# EAGLE design PSU v1.0 (EAGLE 9.1.3)
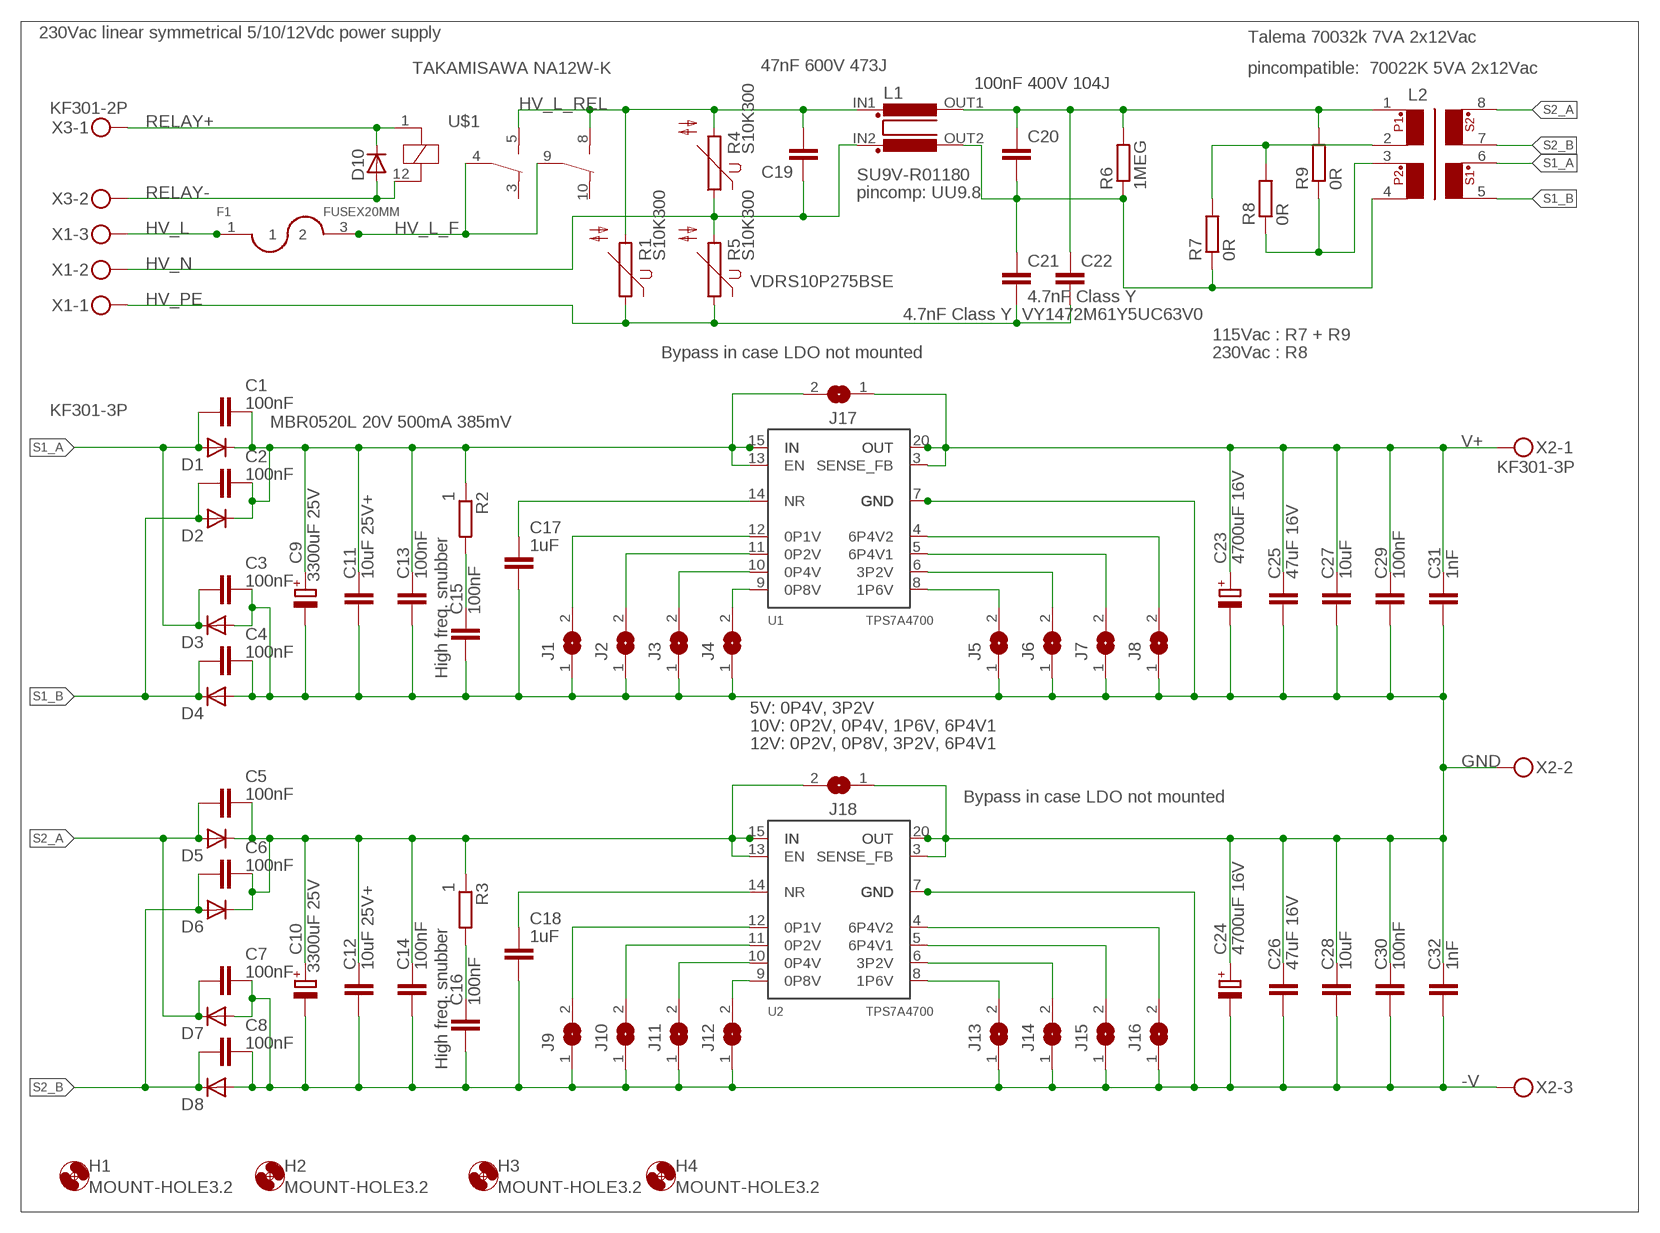
[diagram p0: schematic, sheet 1]

## Parts
C1  100nF  C-EUC0603  [C0603]
C2  100nF  C-EUC0603  [C0603]
C3  100nF  C-EUC0603  [C0603]
C4  100nF  C-EUC0603  [C0603]
C5  100nF  C-EUC0603  [C0603]
C6  100nF  C-EUC0603  [C0603]
C7  100nF  C-EUC0603  [C0603]
C8  100nF  C-EUC0603  [C0603]
C9  3300uF 25V  CPOL-EUE7.5-16  [E7,5-16]
C10  3300uF 25V  CPOL-EUE7.5-16  [E7,5-16]
C11  10uF 25V+  C-EUC1206  [C1206]
C12  10uF 25V+  C-EUC1206  [C1206]
C13  100nF  C-EUC0603  [C0603]
C14  100nF  C-EUC0603  [C0603]
C15  100nF  C-EUC0603  [C0603]
C16  100nF  C-EUC0603  [C0603]
C17  1uF  C-EUC0603  [C0603]
C18  1uF  C-EUC0603  [C0603]
C19  47nF 600V 473J  C-EU102-054X133  [C102-054X133]
C20  100nF 400V 104J  C-EU102-064X133  [C102-064X133]
C21  4.7nF Class Y VY1472M61Y5UC63V0  C-EU102-043X133  [C102-043X133]
C22  4.7nF Class Y  C-EU102-043X133  [C102-043X133]
C23  4700uF 16V  CPOL-EUE7.5-16  [E7,5-16]
C24  4700uF 16V  CPOL-EUE7.5-16  [E7,5-16]
C25  47uF 16V  C-EUC1210  [C1210]
C26  47uF 16V  C-EUC1210  [C1210]
C27  10uF  C-EUC1206  [C1206]
C28  10uF  C-EUC1206  [C1206]
C29  100nF  C-EUC0603  [C0603]
C30  100nF  C-EUC0603  [C0603]
C31  1nF  C-EUC0603  [C0603]
C32  1nF  C-EUC0603  [C0603]
D1  MBR0520L 20V 500mA 385mV  D-SOD123  [SOD123]
D2  D-SOD123  [SOD123]
D3  D-SOD123  [SOD123]
D4  D-SOD123  [SOD123]
D5  D-SOD123  [SOD123]
D6  D-SOD123  [SOD123]
D7  D-SOD123  [SOD123]
D8  D-SOD123  [SOD123]
D10  ES1A 50V 1A 25ns  D-SOD123  [SOD123]
F1  FUSEX20MM  [FUSE_5MM]
H1  MOUNT-HOLE3.2  [3,2]
H2  MOUNT-HOLE3.2  [3,2]
H3  MOUNT-HOLE3.2  [3,2]
H4  MOUNT-HOLE3.2  [3,2]
J1  SJ  [SJ]
J2  SJ  [SJ]
J3  SJ  [SJ]
J4  SJ  [SJ]
J5  SJ  [SJ]
J6  SJ  [SJ]
J7  SJ  [SJ]
J8  SJ  [SJ]
J9  SJ  [SJ]
J10  SJ  [SJ]
J11  SJ  [SJ]
J12  SJ  [SJ]
J13  SJ  [SJ]
J14  SJ  [SJ]
J15  SJ  [SJ]
J16  SJ  [SJ]
J17  SJ  [SJ]
J18  SJ  [SJ]
L1  SU9V-R01180  [SU9V-R01180]
L2  Talema 70032k 7VA 2x12Vac  TALEMA_70000  [TALEMA_70000]
R1  S10K300  [S10K300]
R2  1  R-EU_R0603  [R0603]
R3  1  R-EU_R0603  [R0603]
R4  S10K300  [S10K300]
R5  S10K300  [S10K300]
R6  1MEG  R-EU_0309/12  [0309/12]
R7  0R  R-EU_0204/7  [0204/7]
R8  0R  R-EU_0204/7  [0204/7]
R9  0R  R-EU_0204/7  [0204/7]
U1  TPS7A4700  [VQFN20]
U2  TPS7A4700  [VQFN20]
U$1  TAKAMISAWA NA12W-K  NA_RELAY  [NA_RELAY]
X1  KF301-3P  [KF301-3P]
X2  KF301-3P  [KF301-3P]
X3  KF301-2P  [KF301-2P]

## Nets
-V: C7.2 C8.2 C10.- C12.1 C14.1 C16.1 C18.1 C24.- C26.2 C28.1 C30.1 C32.1 D7.2(A) D8.2(A) J9.1 J10.1 J11.1 J12.1 J13.1 J14.1 J15.1 J16.1 U2.7(GND) U2.17(GND) U2.18(GND) U2.19(GND) U2.21(GND) X2.3
GND: C3.2 C4.2 C9.- C11.1 C13.1 C15.1 C17.1 C23.- C24.+ C25.2 C26.1 C27.1 C28.2 C29.1 C30.2 C31.1 C32.2 D3.2(A) D4.2(A) J1.1 J2.1 J3.1 J4.1 J5.1 J6.1 J7.1 J8.1 J18.1 U1.7(GND) U1.17(GND) U1.18(GND) U1.19(GND) U1.21(GND) U2.1(OUT) U2.3(SENSE_FB) U2.20(OUT) X2.2
HV_L: F1.1 F1.2 X1.3
HV_L_F: F1.3 F1.4 U$1.4(A) U$1.9(B)
HV_L_REL: C19.1 L1.IN1 R1.2 R4.2 U$1.5(A_NO) U$1.8(B_NO)
HV_N: C19.2 L1.IN2 R4.1 R5.2 X1.2
HV_PE: C21.2 C22.2 R1.1 R5.1 X1.1
N$1: C5.2 C6.2 C10.+ C12.2 C14.2 D5.1(C) D6.1(C) J18.2 R3.1 U2.13(EN) U2.15(IN) U2.16(IN)
N$2: C16.2 R3.2
N$3: C20.1 C22.1 L1.OUT1 L2.1 R6.2 R9.2
N$4: C20.2 C21.1 L1.OUT2 L2.4 R6.1 R7.1
N$5: C15.2 R2.2
N$6: C18.2 U2.14(NR)
N$7: L2.2 R7.2 R8.2
N$8: L2.3 R8.1 R9.1
N$9: C1.2 C2.2 C9.+ C11.2 C13.2 D1.1(C) D2.1(C) J17.2 R2.1 U1.13(EN) U1.15(IN) U1.16(IN)
N$11: J13.2 U2.8(1P6V)
N$13: J14.2 U2.6(3P2V)
N$15: C17.2 U1.14(NR)
N$18: J15.2 U2.5(6P4V1)
N$19: J5.2 U1.8(1P6V)
N$20: J6.2 U1.6(3P2V)
N$21: J7.2 U1.5(6P4V1)
N$22: J8.2 U1.4(6P4V2)
N$23: J16.2 U2.4(6P4V2)
N$24: J1.2 U1.12(0P1V)
N$25: J2.2 U1.11(0P2V)
N$26: J3.2 U1.10(0P4V)
N$27: J4.2 U1.9(0P8V)
N$28: J9.2 U2.12(0P1V)
N$29: J10.2 U2.11(0P2V)
N$30: J11.2 U2.10(0P4V)
N$31: J12.2 U2.9(0P8V)
RELAY+: D10.1(C) U$1.1(C+) X3.2
RELAY-: D10.2(A) U$1.12(C-) X3.3
S1_A: C1.1 C3.1 D1.2(A) D3.1(C) L2.6
S1_B: C2.1 C4.1 D2.2(A) D4.1(C) L2.5
S2_A: C5.1 C7.1 D5.2(A) D7.1(C) L2.8
S2_B: C6.1 C8.1 D6.2(A) D8.1(C) L2.7
V+: C23.+ C25.1 C27.2 C29.2 C31.2 J17.1 U1.1(OUT) U1.3(SENSE_FB) U1.20(OUT) X2.1
Unconnected: U$1.3(A_NC) U$1.10(B_NC)

## Notes on the sheet
- 230Vac linear symmetrical 5/10/12Vdc power supply
- pincompatible:  70022K 5VA 2x12Vac
- pincomp: UU9.8
- VDRS10P275BSE
- 115Vac : R7 + R9
- Bypass in case LDO not mounted | 230Vac : R8
- High freq. snubber
- 5V: 0P4V, 3P2V
- 10V: 0P2V, 0P4V, 1P6V, 6P4V1
- 12V: 0P2V, 0P8V, 3P2V, 6P4V1
- Bypass in case LDO not mounted
- High freq. snubber

## Library data of the parts
C1-C8 C11-C22 C25-C32 = rcl:C-EU: CAPACITOR, European symbol
C9 C10 C23 C24 = rcl:CPOL-EU: POLARIZED CAPACITOR, European symbol
D1-D8 D10 = semicon-smd-ipc:D-: DIODE unfilled
F1 = SparkFun:FUSE
H1-H4 = holes:MOUNT-HOLE: MOUNTING HOLE with drill center marker
J1-J18 = jumper:SJ: SMD solder JUMPER
L1 = trafo_JBK:SU9V-R01180
L2 = trafo_JBK:TALEMA_70000: TRANSFORMER 2 primary winding, 2 secondary windings, mounting holes Talema 70032K
R1 R4 R5 = varistor:S10K300: VARISTOR
R2 R3 R6-R9 = rcl:R-EU_: RESISTOR, European symbol
U1 U2 = trafo_JBK:TPS7A4700: The TPS7A47 is a family of positive voltage (+36 V), ultralow-noise (4 µVRMS) low-dropout linear regulators (LDO) capable of sourcing a 1-A load. The TPS7A4700 output voltages are user-programmable (up to 20.5 V) using a printed circuit board (PCB) layout without the need of external resistors or feed-forward capacitors, thus reducing overall component count. The TPS7A4701 output voltage can be configured with a user-programmable PCB layout (up to 20.5 V), or adjustable (up to 34 V) with external feedback resistors. The TPS7A47 is designed with bipolar technology primarily for high-accuracy, high-precision instrumentation applications where clean voltage rails are critical to maximize system performance. This feature makes the device ideal for powering operational amplifiers, analog-to-digital converters (ADCs), digital-to-analog converters (DACs), and other high-performance analog circuitry in critical applications such as medical, radio frequency (RF), and test-and-measurement. In addition, the TPS7A47 is ideal for post dc-dc converter regulation. By filtering out the output voltage ripple inherent to dc-dc switching conversions, maximum system performance is ensured in sensitive instrumentation, test-and-measurement, audio, and RF applications. For applications where positive and negative low-noise rails are required, consider TI’s TPS7A33 family of negative high-voltage, ultralow-noise linear regulators.
U$1 = JBK:NA_RELAY: Fujitsu NA series Slim type relay for high density mounting
X1 X2 = JBK:KF301-3P: KF301-3P connector Ebay KF301-3P Screw Terminal Block Connector 5.08mm Pitch 300V/16A (14-22AWG)
X3 = JBK:KF301-2P: KF301-2P connector Ebay KF301-2P Screw Terminal Block Connector 5.08mm Pitch 300V/16A (14-22AWG)

## Board
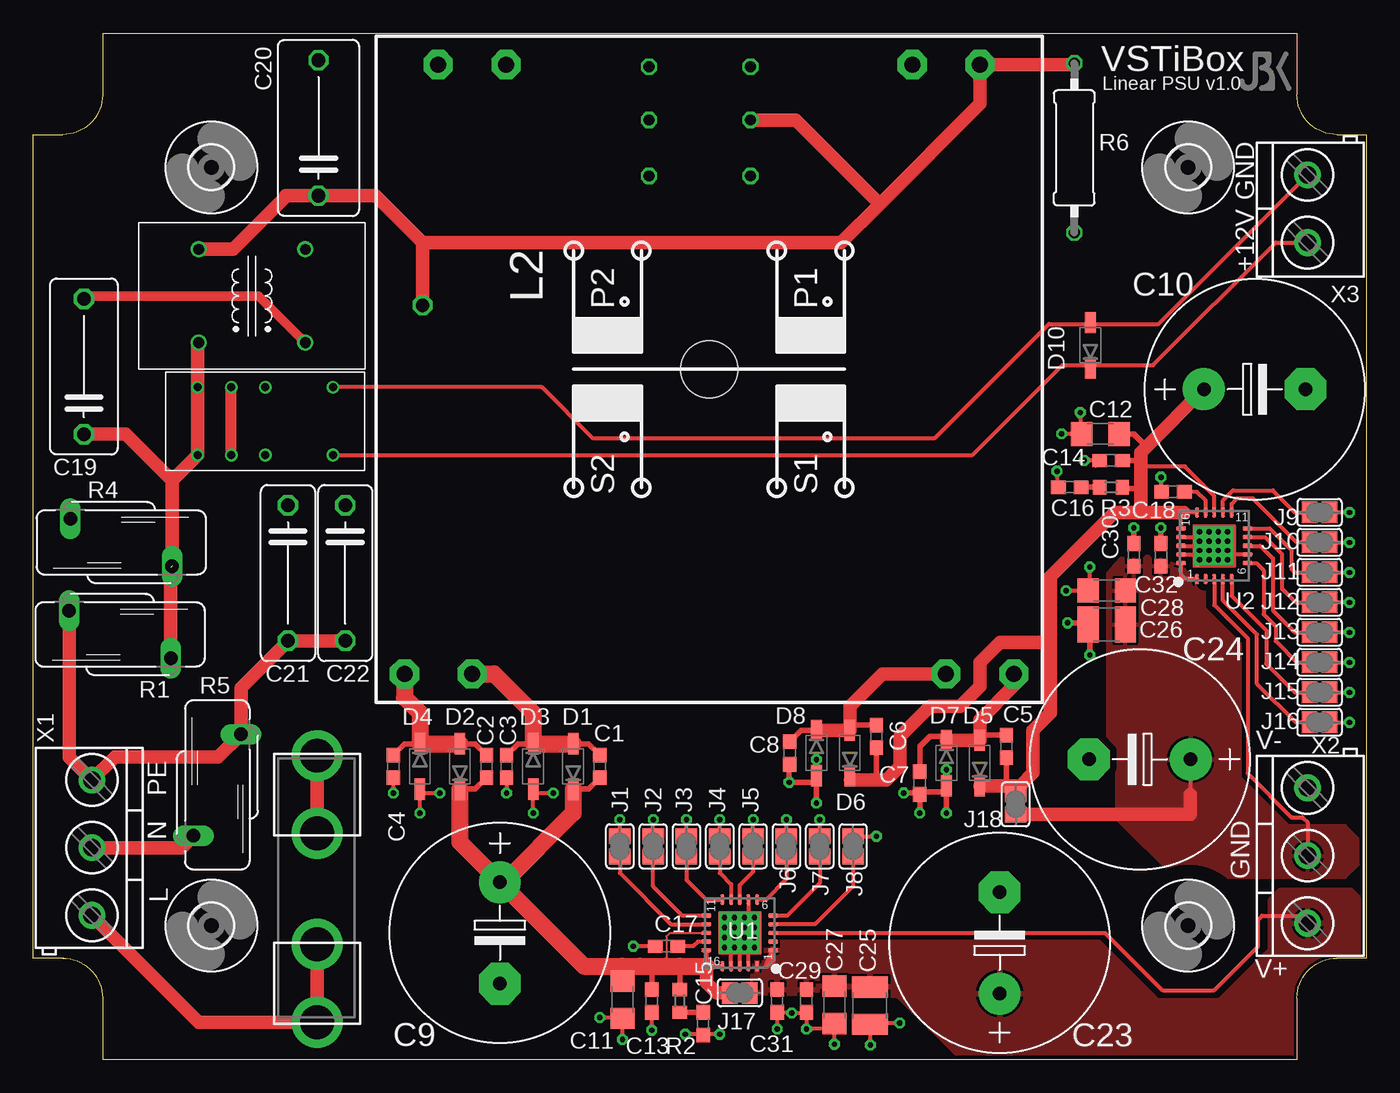
[diagram p1: board, top side]
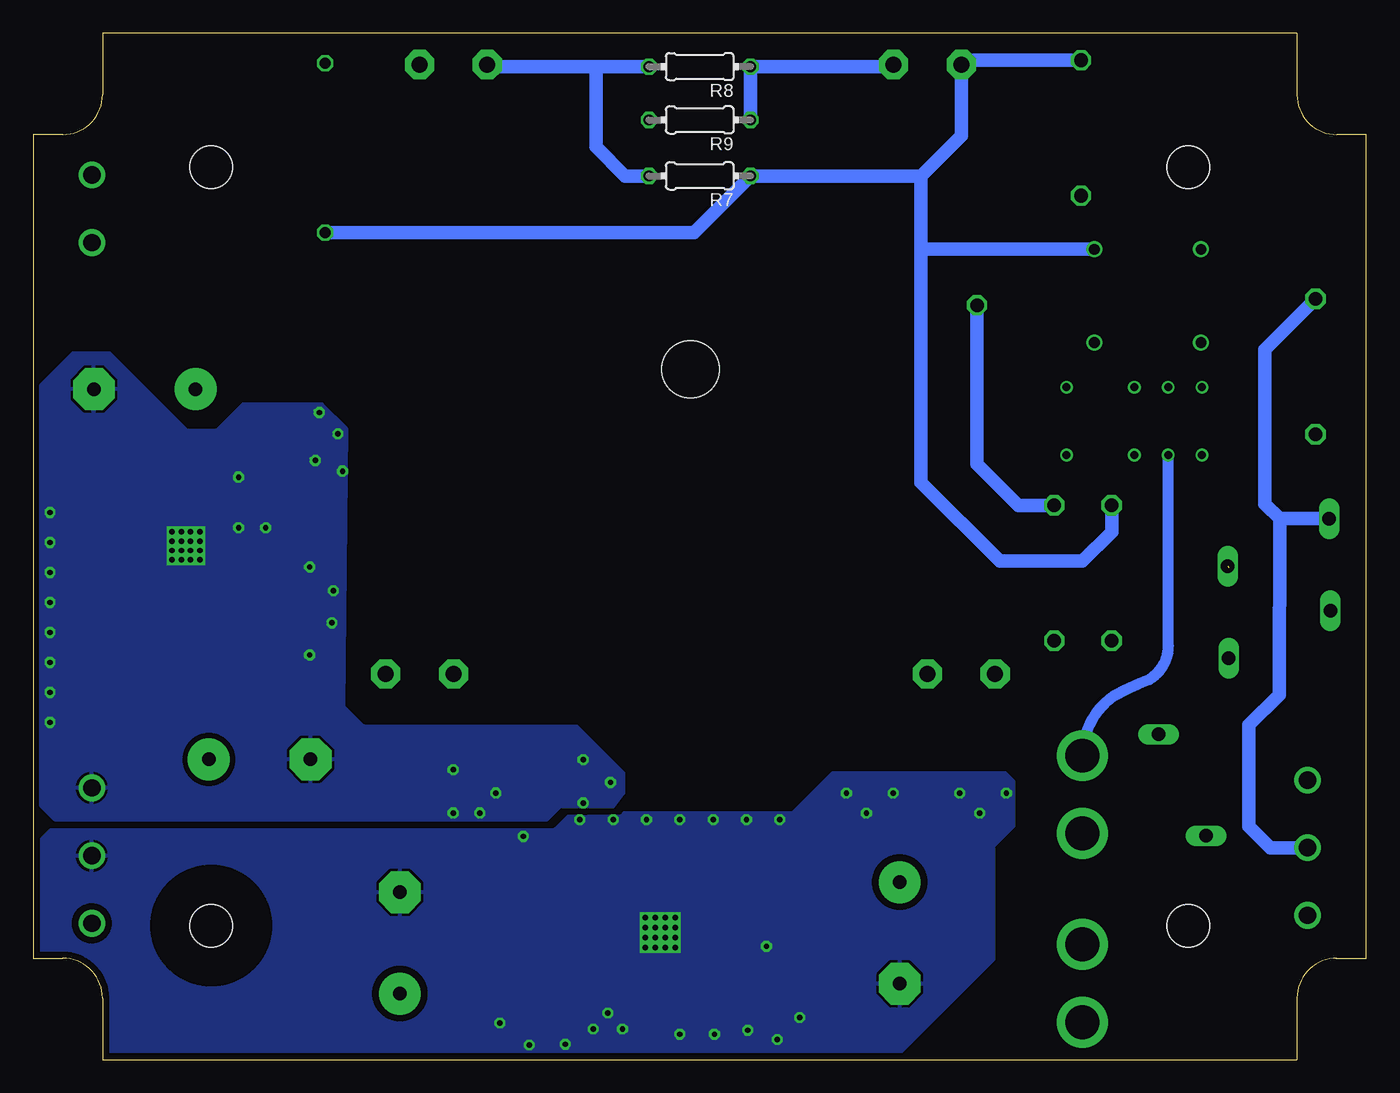
[diagram p2: board, bottom side, seen from below]

Size 100 x 77 mm. Coordinates in mm from the lower left corner, seen from the top.
Outline: 2.3,7.6 2.2,7.6
Outline: 2.2,7.6 0,7.6 0,69.4 2.2,69.4 arc90 5.2,72.4 5.2,77 94.8,77 94.8,72.4 arc90 97.8,69.4 100,69.4 100,7.6 97.8,7.6 arc90 94.8,4.6 94.8,0 5.2,0 5.2,4.6 arc90 2.2,7.6
Copper layers (1*16): Top 0.018mm / dielectric 1.55mm / Bottom 0.018mm
Design rules "eC_2Layer_PClass6_BaseCopperO18_eCDefault *": minimum track width 0.15mm, minimum drill 0.35mm, track to track 0.15mm, track to pad 0.15mm, pad to pad 0.15mm, via to via 0.15mm, smd to smd 0mil, copper to edge 0.25mm, drill to drill 0.35mm, minimum pad ring 0.175mm, minimum via ring 0.125mm, stop-mask expansion 0mil, vias tented up to drill 0.45mm, thermal gap 0.2mm

### Footprints (pad centres in the part's own frame; a part is rotated, then mirrored left to right if it is on the bottom)
C0603 = smd 1.1 x 1: 1 -0.85,0; 2 0.85,0
E7,5-16 = drill 1.016 pad 3.15: + -3.81,0 | drill 1.016 pad 3.15 octagon: - 3.81,0
C1206 = smd 1.6 x 1.8: 1 -1.4,0; 2 1.4,0
C102-054X133 = drill 1.016 octagon: 1 -5.08,0; 2 5.08,0
C102-064X133 = drill 1.016 octagon: 1 -5.08,0; 2 5.08,0
C102-043X133 = drill 1.016 octagon: 1 -5.08,0; 2 5.08,0
C1210 = smd 1.6 x 2.7: 1 -1.4,0; 2 1.4,0
SOD123 = smd 1.6 x 0.8: 1 -1.7,0; 2 1.7,0
FUSE_5MM = drill 2.54 pad 3.556: 1 0,-10; 2 0,-4.158; 3 0,4.158; 4 0,10
3,2 = hole 3.2: 0,0
SJ = smd 1.168 x 1.6: 1 -0.762,0; 2 0.762,0
SU9V-R01180 = drill 0.8: IN1 -3.5,4; IN2 -3.5,-4; OUT1 3.5,4; OUT2 3.5,-4
TALEMA_70000 = drill 1.2 pad 2.184 octagon: 1 -22.86,20.32; 2 -22.86,15.24; 3 -22.86,-15.24; 4 -22.86,-20.32; 5 22.86,-22.86; 6 22.86,-17.78; 7 22.86,17.78; 8 22.86,22.86 | hole 4.3: 0,0
S10K300 = drill 1.016 long: 1 -1.778,-3.81; 2 1.778,3.81
R0603 = smd 1 x 1.1: 1 -0.85,0; 2 0.85,0
0309/12 = drill 0.813 octagon: 1 -6.35,0; 2 6.35,0
0204/7 = drill 0.813 octagon: 1 -3.81,0; 2 3.81,0
VQFN20 = smd 0.75 x 0.3: 1 -2.5,1.3; 2 -2.5,0.65; 3 -2.5,0; 4 -2.5,-0.65; 5 -2.5,-1.3; 11 2.5,-1.3; 12 2.5,-0.65; 13 2.5,0; 14 2.5,0.65; 15 2.5,1.3; 21 -1.23,1.3 | smd 0.3 x 0.75: 6 -1.3,-2.5; 7 -0.65,-2.5; 8 0,-2.5; 9 0.65,-2.5; 10 1.3,-2.5; 16 1.3,2.5; 17 0.65,2.5; 18 0,2.5; 19 -0.65,2.5; 20 -1.3,2.5
NA_RELAY = drill 0.6: 1 -5.08,2.54; 3 0,2.54; 4 2.54,2.54; 5 5.08,2.54; 8 5.08,-2.54; 9 2.54,-2.54; 10 0,-2.54; 12 -5.08,-2.54
KF301-3P = drill 1.3 pad 2: 1 -5.08,0; 2 0,0; 3 5.08,0
KF301-2P = drill 1.3 pad 2: 2 0,0; 3 5.08,0

### Placement (x,y rotation side)
C1  42.5,22 270 top
C2  34,22 270 top
C3  35.5,22 270 top
C4  27,22 270 top
C5  73,23.5 270 top
C6  63.25,24.25 270 top
C7  66.5,20.75 270 top
C8  56.75,23 270 top
C9  35,9.5 270 top
C10  91.64,50.29 0 top
C11  44.2,4.5 90 top
C12  80.05,46.95 0 top
C13  46.4,4.4 90 top
C14  80.85,44.95 0 top
C15  50.25,2.7 90 top
C16  77.75,42.95 0 top
C17  47.5,8.5 0 top
C18  85.5,42.6 0 top
C19  3.8,52 90 top
C20  21.4,69.9 90 top
C21  19.1,36.5 270 top
C22  23.4,36.5 270 top
C23  72.5,8.75 90 top
C24  83.02,22.52 180 top
C25  62.75,4.05 270 top
C26  80.53,32.64 180 top
C27  60.1,4.1 90 top
C28  80.53,35.18 0 top
C29  58,4.4 90 top
C30  82.57,37.87 270 top
C31  55.8,4.4 90 top
C32  84.6,37.87 270 top
D1  40.5,22 90 top
D2  32,22 90 top
D3  37.5,22 270 top
D4  29,22 270 top
D5  71,22.25 90 top
D6  61.25,23 90 top
D7  68.5,22.25 270 top
D8  58.75,23 270 top
D10  79.3,53.6 90 top
F1  21.3,12.8 0 top
H1  13.35,10.05 0 top
H2  86.65,10.05 0 top
H3  86.65,66.95 0 top
H4  13.35,66.95 0 top
J1  44,16 270 top
J2  46.5,16 270 top
J3  49,16 270 top
J4  51.5,16 270 top
J5  54,16 270 top
J6  56.5,16 270 top
J7  59,16 270 top
J8  61.5,16 270 top
J9  96.5,41.05 180 top
J10  96.5,38.8 180 top
J11  96.5,36.55 180 top
J12  96.5,34.3 180 top
J13  96.5,32.05 180 top
J14  96.5,29.8 180 top
J15  96.5,27.55 180 top
J16  96.5,25.3 180 top
J17  53,5 180 top
J18  73.7,19.15 90 top
L1  16.4,57.3 90 top
L2  50.7,51.8 270 top
R1  6.5,31.9 270 top
R2  48.5,4.4 270 top
R3  80.85,42.95 180 top
R4  6.59,38.8 270 top
R5  13.8,20.6 180 top
R6  78.1,68.4 90 top
R7  50,66.3 180 bottom
R8  50,74.5 180 bottom
R9  50,70.5 180 bottom
U1  53,9.5 180 top
U2  88.6,38.55 90 top
U$1  17.4,47.9 180 top
U$2  [JBK_LOGO_SMALL]  90.4,72.9 0 top
X1  4.4,15.89 270 top
X2  95.6,15.3 90 top
X3  95.6,61.3 90 top

### Tracks (layer width: path | path; a pad name or v marks a point on that pad's centre or on a via)
-V  (via drill 0.4 pad 0.8, 0.4 pad 0.81)
  Top 0.305: 79.7,44.55 C14.1 v78.85,44.95 | C8.2 56.7,22.1 | D8.2 58.7,20.9 | C7.2 66.4,20 66.5,20.1 | C16.1 v76.8,44.15 | C12.1 v77.15,46.95 | J10.1 v98.75,38.8 | J11.1 v98.75,36.55 | 97.36,34.15 J12.1 v98.75,34.3 | J14.1 v98.75,29.8 | J15.1 v98.75,27.55 | J16.1 v98.75,25.3 | 97.31,31.75 J13.1 v98.75,32.05 | v98.75,41.05 J9.1 | U2.17 87.5,39.2 v87.5,39.6 | U2.18 87.5,38.55 v87.5,38.9 | U2.19 87.5,37.9 v87.5,38.2 | U2.7 89.6,37.9 v89.6,38.2 | C26.2 79.35,32.92 | U2.21 88.2,37.32 v88.2,37.5 | v78.55,48.55 78.55,46.85 | v84.6,43.7 84.6,42.65 C18.1 | v77.49,35.18 C28.1 79.26,35.18 v79.26,36.96
  Top 0.406: 56.7,22.1 v56.7,20.8 58.6,20.8 | C7.2 v66.5,18.5 | 66.5,20.1 68.6,20.1 D7.2 | 66.4,20 v65.3,20 | v68.5,18.5 D7.2 | D7.2 v68.5,21.75 | v58.75,19.25 D8.2 v58.75,22.5 | v84.6,39.9 C32.1 | v82.57,39.9 C30.1 | v77.6,32.77 79.5,32.77 | v79.26,30.35 79.26,32.64 C26.2
  other vias: 88.2,39.6 88.9,39.6 89.6,39.6 89.6,38.9 88.9,38.9 88.2,38.9 87.5,37.5 88.2,38.2 88.9,38.2 88.9,37.5 89.6,37.5
  pour Bottom (isolate 0.4, rank 2): 94.3,53 88.5,47.2 86.2,47.2 84.2,49.2 78.4,49.2 76.55,47.35 76.75,26.5 75.25,25 59.25,25 55.75,21.5 55.75,20 56.5,19 60.5,19 61.5,18 98.35,18 99.4,19.05 99.4,50.6 97,53
  pour Bottom (no thermals): 86.7,40.4 90.5,40.4 90.5,36.8 86.7,36.8
GND  (via drill 0.4 pad 0.8)
  Top 0.305: U2.1 86.1,36.05 U2.20 | U1.19 53.65,8.4 v53.35,8.4 53,8.4 U1.18 | U1.17 52.35,8.4 v52.6,8.4 | U1.21 54.23,8.4 v54.1,8.4 | U1.7 53.65,10.65 v53.35,10.65 | U2.3 88.6,34.1 91.1,31.6 91.1,21.48 94.4,18.18 95.21,18.18 95.6,17.79 X2.2 | 86.8,19.9 86.83,19.9 C24.+ | C17.1 v45,8.5 | J1.1 v44,18 | J2.1 v46.5,18 | J3.1 v49,18 | J4.1 v51.5,18 | J5.1 v54,18 | J6.1 v56.5,18 | J7.1 v59,18 | J8.1 63.25,16.76 v63.25,16.75 | C3.2 v35.5,20 | v37.5,18.5 37.5,20 | D3.2 37.8,20 v39,20 | v29,18.5 D4.2 29.3,20 v30.5,20 | v44.2,1.5 44.2,3 | C11.1 44.15,3.15 v42.5,3.15 | v46.4,2.2 C13.1 | v51.5,1.9 50.2,1.9 | C15.1 50.2,1.9 | 50.2,1.9 v48.9,1.9 | 55.8,3.5 v56.9,3.5 58.2,3.5 | C29.1 v58,2.3 59.7,2.3 C27.1 v60.1,1.15 | C31.1 55.8,3.5 | 55.8,3.5 v55.8,2.3 | v65,2.75 62.85,2.75 arc90 C25.2 62.8,2.6 v62.8,1.1 | C4.2 v27,20
  Top 1.016: J18.1 86.8,18.39 86.8,19.9
  other vias: 51.85,10.65 52.6,10.65 54.1,10.65 51.85,9.9 52.6,9.9 53.35,9.9 54.1,9.9 54.1,9.15 53.35,9.15 52.6,9.15 51.85,9.15 51.85,8.4
  pour Bottom (isolate 0.5, rank 4): 99.4,0.5 99.4,16.5 98.4,17.5 61,17.5 60,18.5 43,18.5 40,21.5 27.1,21.5 26.5,20.9 26.5,17.5 28,16 28,7.5 35,0.5
  pour Top (isolate 0.5, rank 2): 85.7,13.7 98.4,13.7 99.4,14.7 99.4,16.5 98.4,17.5 94.14,17.5 90.5,21.14 90.5,31.2 87.85,33.85 87.85,36.95 85.9,38.9 82.78,38.9 80.6,36.47 80.6,24 81.3,23.3 81.3,18.1
  pour Bottom (rank 3, no thermals): 51,11.5 51,7.5 55.2,7.5 55.2,11.4 55.2,11.5
HV_L
  Top 1: F1.2 F1.1 12.41,2.8 X1.3
HV_L_F
  Top 0.813: U$1.4 U$1.9
  Top 1: F1.3 F1.4
  Bottom 0.813: U$1.4 14.86,31.14 arc61 16.3,28.5 arc-6 18.9,27.3 arc-55 F1.4
HV_L_REL  (1 unrouted)
  Top 1: 10.31,36.93 R1.2 | 10.4,43.44 R4.2 | L1.IN1 12.32,53.72 U$1.8 U$1.5 10.4,43.44 | C19.1 6.92,46.92 10.4,43.44
HV_N
  Top 0.7: C19.2 4.02,57.3 16.9,57.3 L1.IN2
  Top 1: X1.2 11.13,15.89 R5.2
  Bottom 1: C19.2 7.6,53.28 7.6,41.68 6.5,40.58 | 6.5,40.58 6.51,27.37 6.53,27.37 8.8,25.1 8.8,17.5 7.19,15.89 X1.2 | R4.1 6.5,40.58
HV_PE
  Top 1: C21.2 C22.2 | 19,31.42 C21.2 | R1.1 2.69,22.68 X1.1 6.13,22.7 13.87,22.7 R5.1 15.58,27.9 C21.2
N$1
  Top 0.305: R3.1 81.8,42.95 81.9,42.85 | U2.16 86.1,41.05 86.3,41.05 U2.15 | U2.13 88.6,42.3 86.4,44.5 83.3,44.5 83.1,43.7 83.1,42.85 83.2,42.85 | J18.2 73.4,20.21 73.4,20.55 | D6.1 61.3,21.25 61.3,21
  Top 0.406: C6.2 63.25,21 | C14.2 83.1,44.95 83.1,44.9 | 81.9,42.85 83.2,42.85 83.2,42.8 | C5.2 73,20.55 | C12.2 82.55,46.95 83.47,46.03 83.57,46.03
  Top 1: 76.3,35.75 76.3,36.26 81.09,41.05
  Top 1.016: 61.3,21 63.25,21 64,21 65,22 65,24.25 67.25,26.5 69.5,26.5 71,28 71,29.8 72.5,31.3 76.3,31.3 | 76.3,31.3 76.3,26 75,24.7 75,21.5 74.05,20.55 73.4,20.55 73,20.55 D5.1 | 76.3,31.3 76.3,35.75 | 81.09,41.05 83.1,41.05 | 83.1,41.05 86.3,41.05 | 83.1,41.05 83.1,43.7 83.1,44.9 83.1,45.56 83.57,46.03 C10.+
N$2
  Top 0.406: C16.2 R3.2
N$3  (via drill 1)
  Top 1: 18.92,64.82 19,64.82 | 19,64.82 C20.1 25.68,64.82 29.2,61.3 29.4,61.3 | L2.1 71.02,71.72 63.5,64.2 | 63.5,64.2 60.6,61.3 29.4,61.3 | R9.2 57.2,70.5 63.5,64.2 | v29.2,56.6 29.2,61.1 29.4,61.3 | L1.OUT1 14.98,60.8 19,64.82
  Top 1.016: L2.1 78.01,74.66 R6.2
  Bottom 1: v29.2,56.6 29.2,44.7 26.08,41.58 C22.1
N$4
  Bottom 0.305: 33.4,66.3 33.2,66.1 33.2,60.8 33.2,60.5
  Bottom 1: C20.2 30.06,74.98 L2.4 30.38,69.32 33.4,66.3 | 50.44,62.05 R7.1 33.4,66.3 | 33.4,66.3 33.4,43.3 27.5,37.4 21.3,37.4 19.1,39.6 C21.1 | L1.OUT2 33.2,60.8
  Bottom 1.016: 50.44,62.05 76.83,62.05 R6.1
N$5
  Top 0.406: R2.2 C15.2
N$6
  Top 0.305: U2.14 87.95,41.95 87.3,42.6 C18.2
N$7
  Bottom 1: R7.2 55.6,66.3 57.8,68.5 57.8,74.5 | 57.8,74.5 R8.2 | 65.94,74.5 57.8,74.5
  Bottom 1.676: L2.2 65.94,74.5
N$8
  Bottom 1: 35.46,74.5 R8.1 R9.1
  Bottom 1.676: L2.3 35.46,74.5
N$9
  Top 0.15: 47.5,7 47.5,9.25 47.75,9.5 U1.13
  Top 0.305: U1.16 50.5,7 | 46.4,6.9 45.5,7 | U1.15 50.5,6.5
  Top 0.406: C11.2 44.2,7 | C13.2 46.4,6.9 | R2.1 48.5,7 | C1.2 41.65,20.3 D1.1 | C2.2 33.15,20.3 D2.1
  Top 1.016: J17.2 51.25,5 50.5,5.75 50.5,6.5 50.5,7
  Top 1.27: C9.+ 32,16.31 D2.1 | D1.1 40.5,18.5 35.31,13.31 C9.+ | C9.+ 41.31,7 44.2,7 45.5,7 47.5,7 48.5,7 50.5,7
N$11
  Top 0.305: U2.8 92.05,38.55 93,37.6 93,33.7 94.65,32.05 J13.2
N$13
  Top 0.305: U2.6 91.75,37.25 92.3,36.7 92.3,33.4 93.2,32.5 93.2,31.4 94.8,29.8 J14.2
N$15
  Top 0.305: U1.14 49.85,8.85 49.5,8.5 C17.2
N$18
  Top 0.305: U2.5 89.9,34.8 92.5,32.2 92.5,29.7 94.65,27.55 J15.2
N$19
  Top 0.305: J5.2 54,14.1 53,13.1 U1.8
N$20
  Top 0.305: J6.2 56.5,13.55 54.95,12 U1.6
N$21
  Top 0.305: J7.2 59,13.25 56.55,10.8 U1.5
N$22
  Top 0.305: J8.2 61.5,13 58.65,10.15 U1.4
N$23
  Top 0.305: J16.2 94.7,25.3 91.8,28.2 91.8,31.9 89.25,34.45 U2.4
N$24
  Top 0.305: J1.2 44,14 47.85,10.15 U1.12
N$25
  Top 0.305: U1.11 48.7,10.8 46.5,13 J2.2
N$26
  Top 0.305: J3.2 49,13.5 50.5,12 U1.10
N$27
  Top 0.305: J4.2 51.5,14 52.35,13.15 U1.9
N$28
  Top 0.305: U2.12 89.25,41.95 90,42.7 93,42.7 94.65,41.05 J9.2
N$29
  Top 0.305: U2.11 89.9,41.7 90.3,42.1 91.5,42.1 94.8,38.8 J10.2
N$30
  Top 0.305: U2.10 92.75,39.85 94.4,38.2 94.4,36.8 94.65,36.55 J11.2
N$31
  Top 0.305: U2.9 92.4,39.2 93.7,37.9 93.7,35.3 94.7,34.3 J12.2
RELAY+
  Top 0.305: 79.5,52.1 84,52.1 93.2,61.3 X3.2 | D10.1 79.5,51.75 79.5,52.1 | U$1.1 70.46,45.36 77.2,52.1 79.5,52.1
RELAY-
  Top 0.305: 79.3,55.2 76.2,55.2 67.6,46.6 42,46.6 38.16,50.44 U$1.12 | 79.3,55.2 84.42,55.2 X3.3 | D10.2 79.3,55.2
S1_A
  Top 0.406: C3.1 36.35,23.7 D3.1 | C1.1 41.65,23.7 D1.2
  Top 1.27: L2.6 34.56,28.94 37.5,26 D3.1 D1.2
S1_B
  Top 0.406: C4.1 27.85,23.7 D4.1 | D2.2 33.15,23.7 C2.1
  Top 1.27: L2.5 27.84,27.16 29,26 D4.1 D2.2
S2_A
  Top 0.305: D7.1 68.45,24.25
  Top 0.406: 68.45,24.25 67.25,24.25 66.5,23.5 C7.1 | 71.05,24.25 71.15,24.35 C5.1
  Top 1.016: D5.2 71,25.5 73.56,28.06 L2.8 | D7.1 D5.2 | 71.05,24.25 71,24.2 D5.2
S2_B
  Top 0.406: D6.2 61.3,25.1 C6.1 | C8.1 57.6,24.7 D8.1
  Top 1.016: D8.1 D6.2 61.25,26.5 63.69,28.94 L2.7
V+
  Top 0.305: U1.3 80.4,9.5 84.7,5.2 88.6,5.2 91.9,8.5 91.9,10.5 92.2,10.8 95.33,10.8 X2.1
  Top 0.406: U1.1 55,7 55.5,7.5 U1.1
  pour Top: 55,7.25 55,8.8 79.9,8.8 84.3,4.4 89,4.4 92.8,8.2 92.8,11.9 93.6,12.7 98.8,12.7 99.4,12.1 99.4,0.5 69.25,0.5 64.95,4.8 64.85,4.8 54,5 54,7.25

### Text on the board
tNames: VSTiBox | Linear PSU v1.0 | GND | +12V | V- | PE | N | GND | L | V+